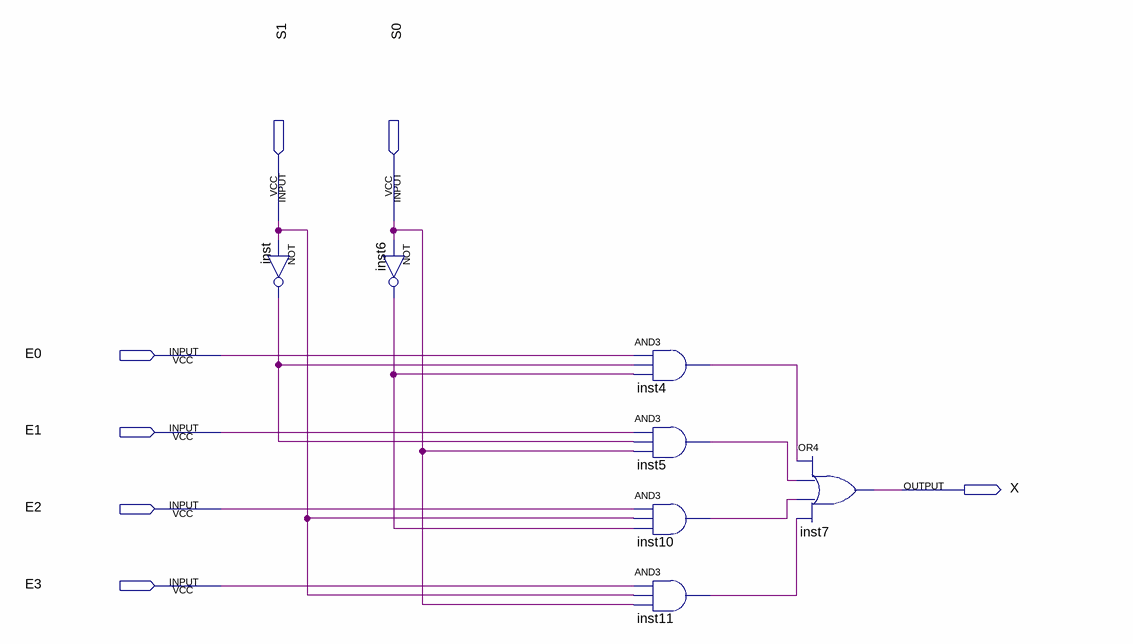
[diagram p0: schematic sheet]
// Quartus schematic mux_4x1.bdf as structural Verilog: 7 symbols, 7 pins
module mux_4x1 (
  input  S1,
  input  S0,
  input  E0,
  input  E1,
  input  E2,
  input  E3,
  output X
);

  wire inst4_out, inst5_out, inst6_out, inst10_out, inst11_out, inst_out;

  not inst (inst_out, S1);
  not inst6 (inst6_out, S0);
  and inst4 (inst4_out, E0, inst_out, inst6_out);
  and inst5 (inst5_out, E1, inst_out, S0);
  and inst10 (inst10_out, E2, S1, inst6_out);
  and inst11 (inst11_out, E3, S1, S0);
  or inst7 (X, inst4_out, inst5_out, inst10_out, inst11_out);
endmodule
